# EAGLE design 30w developer board v2 (EAGLE 5.07)
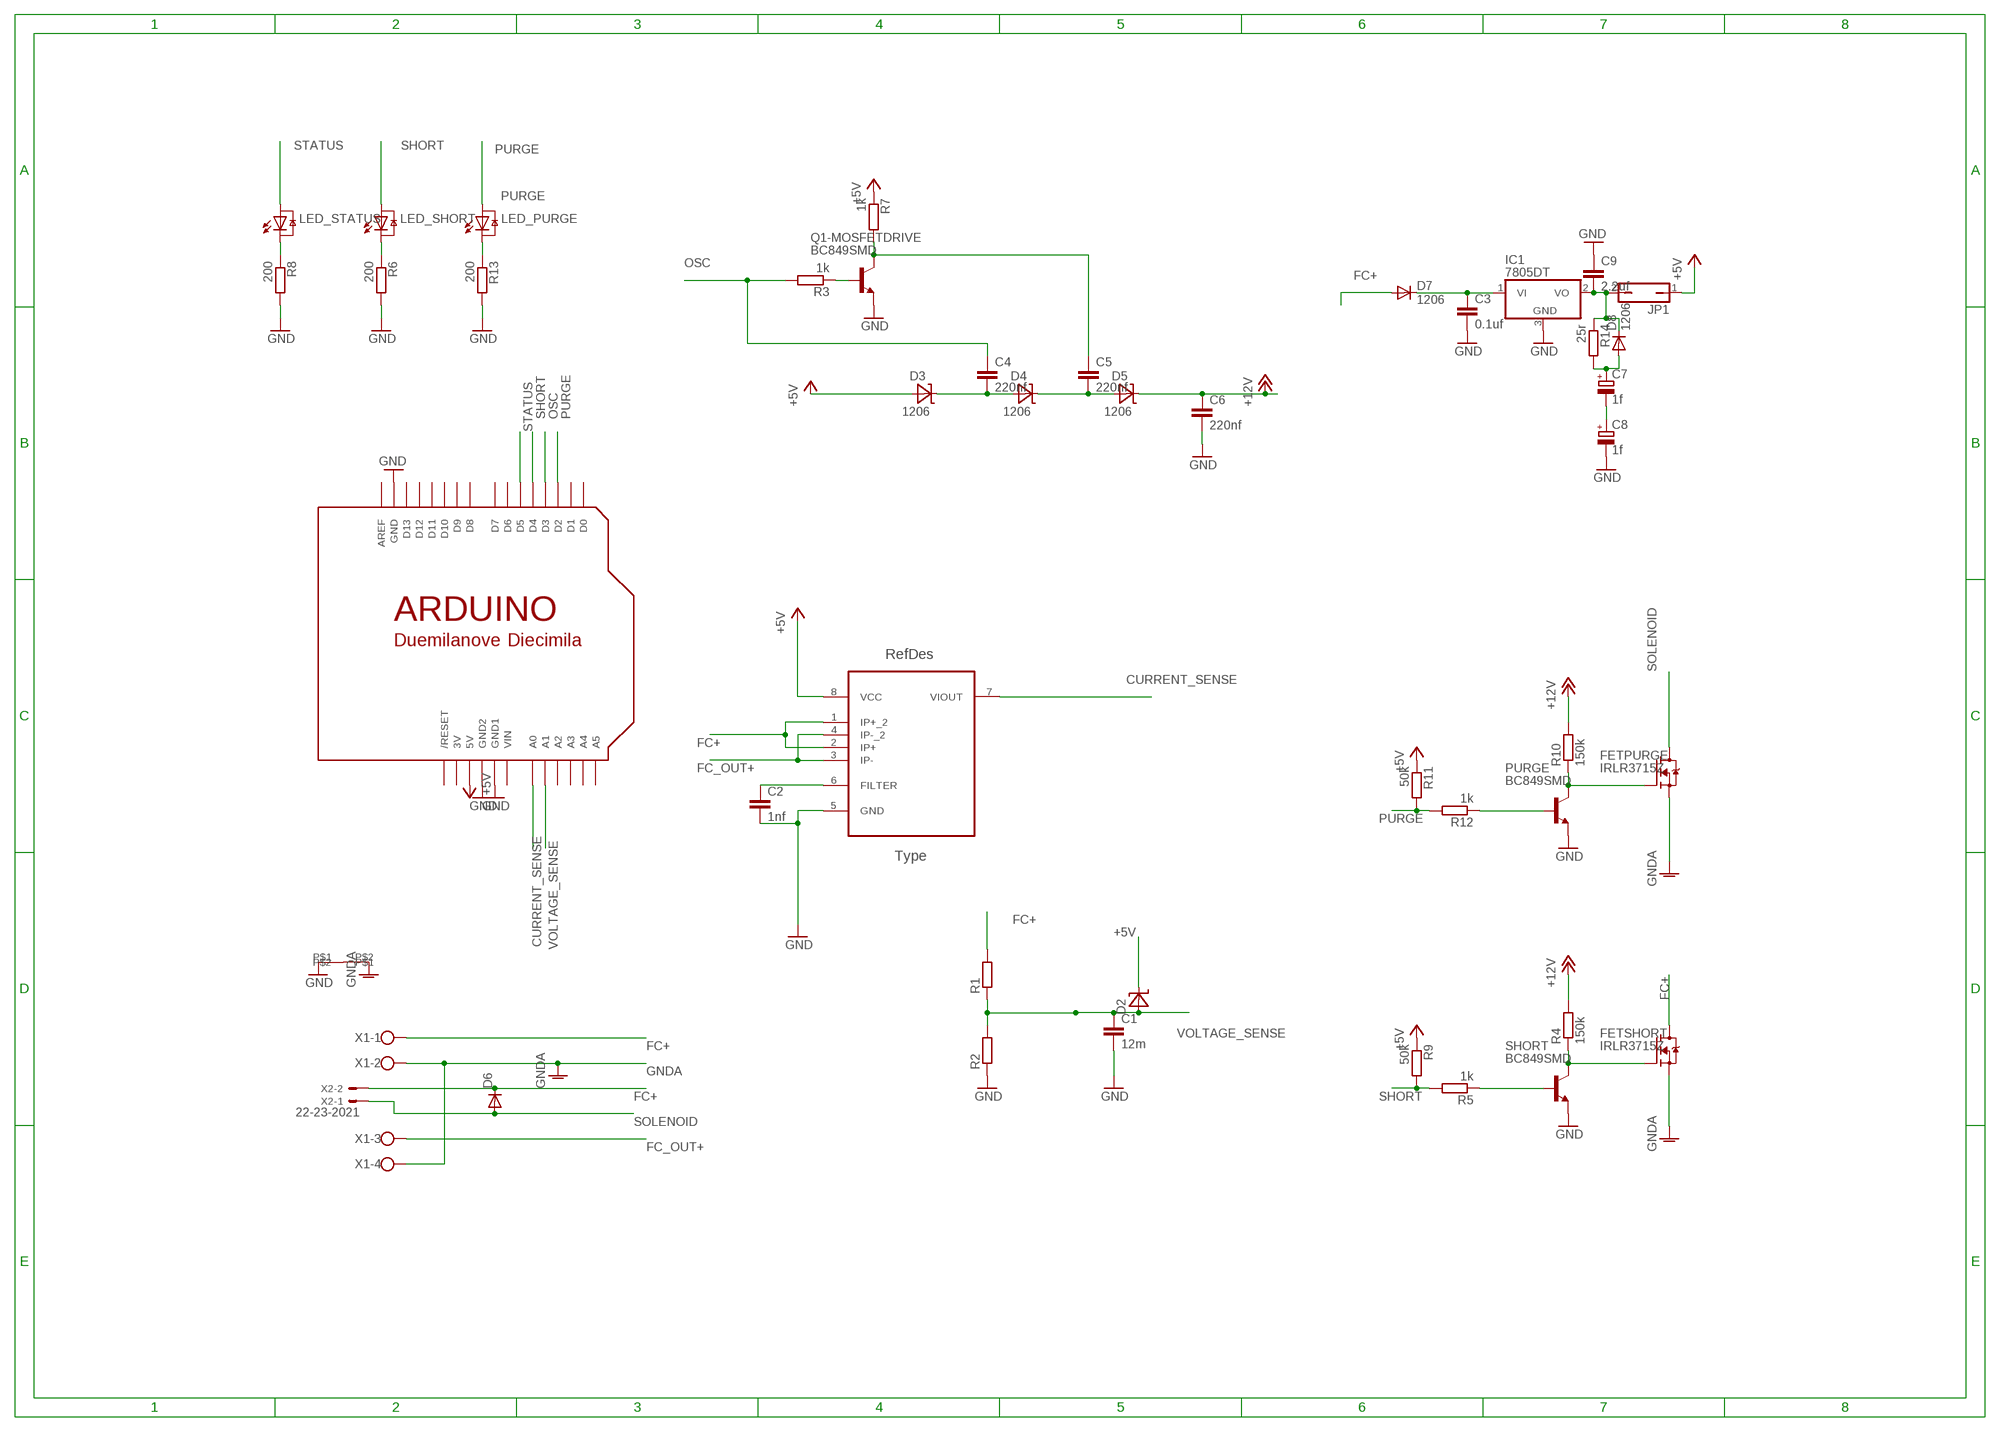
[diagram p0: schematic, sheet 1]

## Parts
C1  12m  C-EUC1206  [C1206]
C2  1nf  C-EUC1206  [C1206]
C3  0.1uf  C-EUC1206  [C1206]
C4  220nf  C-EUC1206  [C1206]
C5  220nf  C-EUC1206  [C1206]
C6  220nf  C-EUC1206  [C1206]
C7  1f  CPOL-EUE5-10.5  [E5-10,5]
C8  1f  CPOL-EUE5-10.5  [E5-10,5]
C9  2.2uf  C-EUC1206  [C1206]
D2  1206ZENER  [C1206]
D3  1206  [C1206]
D4  1206  [C1206]
D5  1206  [C1206]
D6  DIODE-GF1  [GF1]
D7  1206  DIODE-GF1  [GF1]
D8  1206  DIODE-GF1  [GF1]
FETPURGE  IRLR3715Z  [TO252]
FETSHORT  IRLR3715Z  [TO252]
IC1  7805DT  [TO252]
JP1  JP1Q  [JP1]
LED_PURGE  GM5BW96385A  [GM5BW96385A]
LED_SHORT  GM5BW96385A  [GM5BW96385A]
LED_STATUS  GM5BW96385A  [GM5BW96385A]
PURGE  BC849SMD  [SOT23-BEC]
Q1-MOSFETDRIVE  BC849SMD  [SOT23-BEC]
R1  R-EU_R1206  [R1206]
R2  R-EU_R1206  [R1206]
R3  1k  R-EU_M1206  [M1206]
R4  150k  R-EU_M1206  [M1206]
R5  1k  R-EU_M1206  [M1206]
R6  200  R-EU_M1206  [M1206]
R7  1k  R-EU_M1206  [M1206]
R8  200  R-EU_M1206  [M1206]
R9  50k  R-EU_M1206  [M1206]
R10  150k  R-EU_M1206  [M1206]
R11  50k  R-EU_M1206  [M1206]
R12  1k  R-EU_M1206  [M1206]
R13  200  R-EU_M1206  [M1206]
R14  25r  R-EU_M1206  [M1206]
SHORT  BC849SMD  [SOT23-BEC]
U1  ACS712ELCTR-05B-T  [SOIC127P600X175-8N]
U$1  ARDUINO-NOHOLE  [ARDUINO-NOHOLE]
U$2  SHORT  [SHORT]
X1  W237-4  [W237-4]
X2  22-23-2021  [22-23-2021]

## Nets
+5V [medpower]: D2.CATHODE(C) D3.ANODE(A) JP1.1 R7.1 R9.1 R11.1 U1.8(VCC) U$1.5V
+12V: C6.1 D5.CATHODE(C) R4.2 R10.2
CURRENT_SENSE: U1.7(VIOUT) U$1.A0
FC+ [power]: D6.C D7.A FETSHORT.3(D) R1.2 U1.1(IP+_2) U1.2(IP+) X1.1 X2.2
FC_OUT+ [power]: U1.3(IP-) U1.4(IP-_2) X1.3
GND [medpower]: C1.2 C2.2 C3.2 C6.2 C8.- C9.1 IC1.3(GND) PURGE.E Q1-MOSFETDRIVE.E R2.1 R6.2 R8.2 R13.2 SHORT.E U1.5(GND) U$1.GND U$1.GND1 U$1.GND2 U$2.P$1
GNDA [power]: FETPURGE.2(S) FETSHORT.2(S) U$2.P$2 X1.2 X1.4
N$1: C9.2 D8.C IC1.2(VO) JP1.2 R14.1
N$2: C7.- C8.+
N$3: FETSHORT.1(G) R4.1 SHORT.C
N$4: FETPURGE.1(G) PURGE.C R10.1
N$5: C2.1 U1.6(FILTER)
N$6: C4.2 D3.CATHODE(C) D4.ANODE(A)
N$7: C5.2 D4.CATHODE(C) D5.ANODE(A)
N$8: PURGE.B R12.1
N$9: C3.1 D7.C IC1.1(VI)
N$11: C5.1 Q1-MOSFETDRIVE.C R7.2
N$12: Q1-MOSFETDRIVE.B R3.1
N$13: LED_SHORT.C R6.1
N$14: R5.1 SHORT.B
N$15: LED_PURGE.C R13.1
N$16: LED_STATUS.C R8.1
N$17: C7.+ D8.A R14.2
OSC: C4.1 R3.2 U$1.D3
PURGE: LED_PURGE.A R11.2 R12.2 U$1.D2
SHORT: LED_SHORT.A R5.2 R9.2 U$1.D4
SOLENOID [medpower]: D6.A FETPURGE.3(D) X2.1
STATUS: LED_STATUS.A U$1.D5
VOLTAGE_SENSE: C1.1 D2.ANODE(A) R1.1 R2.2 U$1.A1
Unconnected: U$1.A2 U$1.A3 U$1.A4 U$1.A5 U$1.AREF U$1.D0 U$1.D1 U$1.D6 U$1.D7 U$1.D8 U$1.D9 U$1.D10 U$1.D11 U$1.D12 U$1.D13 U$1.RESET(/RESET)

## Power pins joined to a net without a drawn wire
3V: U$1.3V
VIN: U$1.VIN

## Library data of the parts
C1 C2 = matt rcl:C-EU: CAPACITOR, European symbol
C3-C6 C9 = resistor:C-EU: CAPACITOR, European symbol
C7 C8 = matt rcl:CPOL-EU: POLARIZED CAPACITOR, European symbol
D2 = matt diode:1206ZENER
D3-D5 = matt diode:1206
D6-D8 = matt diode:DIODE-: DIODE
FETPURGE FETSHORT = matt transistor-fet:IRLR3715Z
IC1 = linear:78*: Positive VOLTAGE REGULATOR Source: http://cache.national.com/ds/LM/LM78L05.pdf http://www.fairchildsemi.com/ds/LM/LM7805.pdf
JP1 = jumper:JP1Q: JUMPER
LED_PURGE LED_SHORT LED_STATUS = matt led:GM5BW96385A: High brightness White Color LED 2300 mcd @ IF = 20mA achieved via InGaN Blue LED chip in combination with Yellow Phosphor Source: http://document.sharpsma.com/files/GM5BW96385A.pdf
PURGE Q1-MOSFETDRIVE SHORT = matt transistor-npn:BC849*: NPN Transistor
R1 R2 = matt rcl:R-EU_: RESISTOR, European symbol
R3-R14 = resistor:R-EU_: RESISTOR, European symbol
U1 = matt-allegro:ACS712ELCTR-05B-T: Linear Current Sensor; DESCRIPTION: Linear Current Sensor; MPN: ACS712ELCTR-05B-T; OC_FARNELL: 27M3644; OC_NEWARK: 1329623; PACKAGE: SOIC-8; SUPPLIER: Allegro
U$1 = adafruit:ARDUINO: Arduino Diecimila/Duemilanove Make a shield with ease, this package has all the named pins as well as the two mounting drill holes and an outline of the USB and DC power connector. The outline is on the DIMENSION layer, so if your board house uses it they will cut the outline to match. http://www.ladyada.net/library/pcb/eaglelibrary.html
U$2 = matt:SHORT
X1 = con-wago-500:W237-4: WAGO SCREW CLAMP
X2 = con-molex:22-23-2021: .100" (2.54mm) Center Header - 2 Pin

## Net classes
1 power: width 3 mm
2 medpower: width 1 mm

## Board
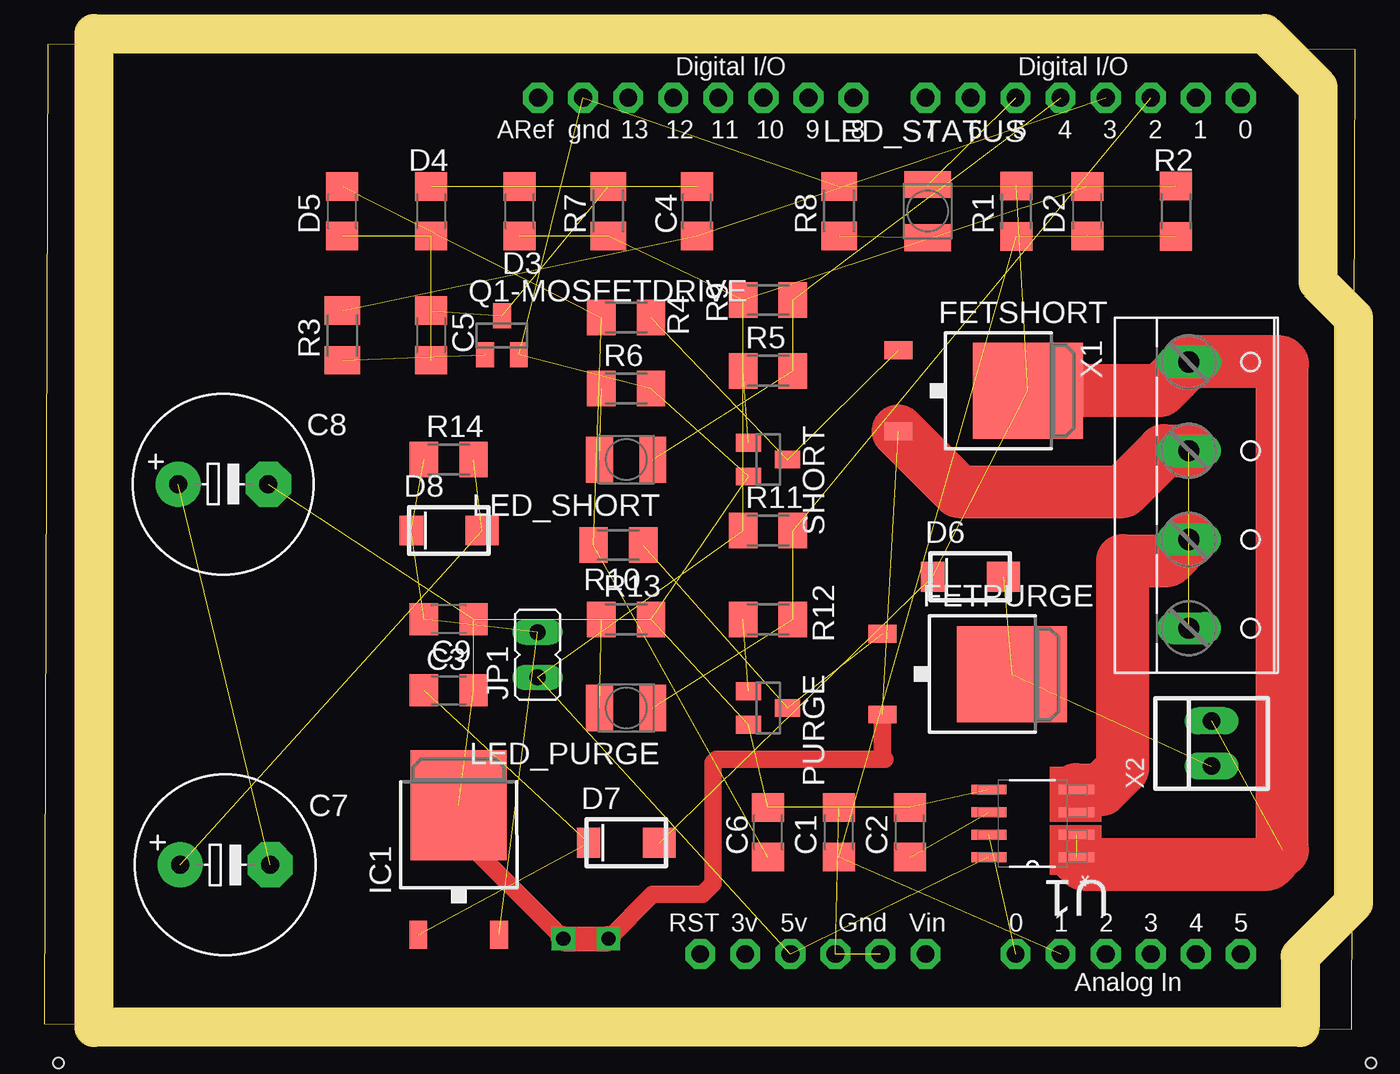
[diagram p1: board, top side]
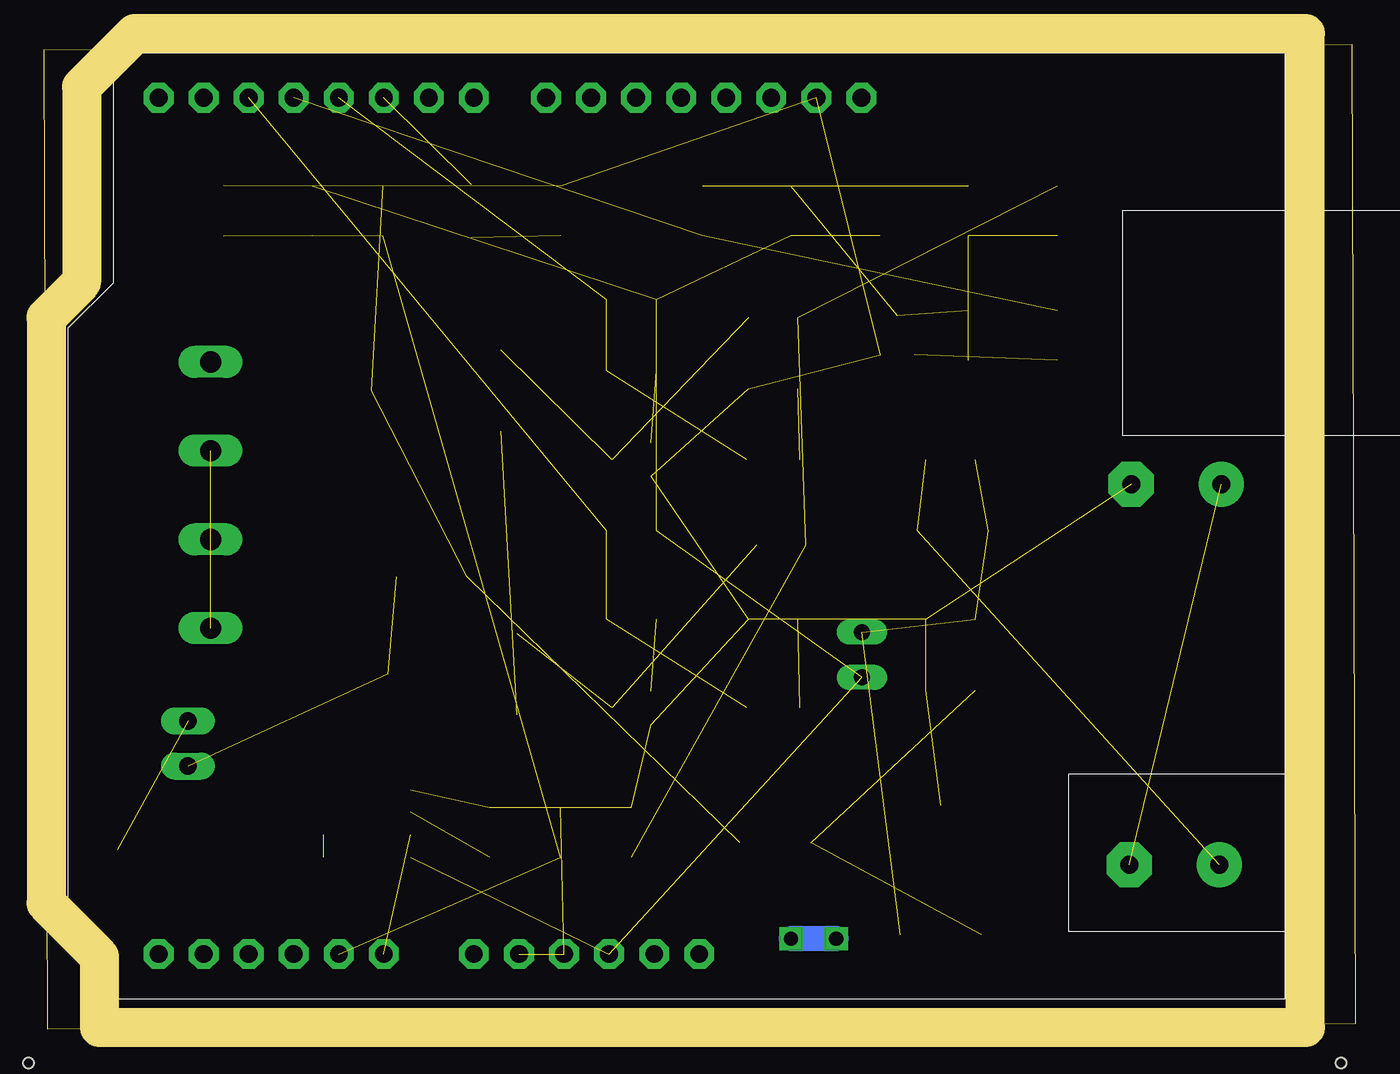
[diagram p2: board, bottom side, seen from below]

Size 73.9 x 55.5 mm. Coordinates in mm from the lower left corner, seen from the top.
Outline: 0,0.3 73.7,0 73.9,55.2 0.2,55.5 0,0.3
Copper layers (1*16): Top 0.035mm / dielectric 1.5mm / Bottom 0.035mm
Design rules "default *": minimum track width 0.5mm, minimum drill 24mil, track to track 8mil, track to pad 8mil, pad to pad 8mil, via to via 8mil, smd to smd 8mil, copper to edge 40mil, drill to drill 8mil, minimum pad ring 10mil, minimum via ring 8mil, stop-mask expansion 4mil, vias tented up to drill 0mil, thermal gap 10mil
Holes 0.6 mm at 0.8,-1.9 74.8,-1.9
Milling: 9 lines

### Footprints (pad centres in the part's own frame; a part is rotated, then mirrored left to right if it is on the bottom)
C1206 = smd 1.6 x 1.8: 1 -1.4,0; 2 1.4,0
E5-10,5 = drill 1.016 pad 2.54 round: + -2.54,0 | drill 1.016 pad 2.54 octagon: - 2.54,0
C1206' = smd 1.6 x 1.8: ANODE -1.4,0; CATHODE 1.4,0
GF1 = smd 1.85 x 1.68: A 1.87,0 | smd 1.32 x 1.68: C -2.12,0
TO252 = smd 1 x 1.6: 1 -2.28,-4.8; 2 2.28,-4.8 | smd 5.4 x 6.2: 3 0,2.5
JP1 = drill 0.914 long: 1 0,-1.27; 2 0,1.27
GM5BW96385A = smd 1.5 x 2.6: A -1.5,0; C 1.5,0
SOT23-BEC = smd 1 x 1.4: B -0.95,-1.1; C 0,1.1; E 0.95,-1.1
R1206 = smd 1.6 x 1.803: 1 -1.422,0; 2 1.422,0
M1206 = smd 1.6 x 2: 1 -1.4,0; 2 1.4,0
SOIC127P600X175-8N = smd 1.981 x 0.559: 1 -2.464,1.905; 2 -2.464,0.635; 3 -2.464,-0.635; 4 -2.464,-1.905; 5 2.464,-1.905; 6 2.464,-0.635; 7 2.464,0.635; 8 2.464,1.905
ARDUINO-NOHOLE = drill 1 pad 1.676 octagon: 3V 35.56,2.54; 5V 38.1,2.54; A0 50.8,2.54; A1 53.34,2.54; A2 55.88,2.54; A3 58.42,2.54; A4 60.96,2.54; A5 63.5,2.54; AREF 23.876,50.8; D0 63.5,50.8; D1 60.96,50.8; D2 58.42,50.8; D3 55.88,50.8; D4 53.34,50.8; D5 50.8,50.8; D6 48.26,50.8; D7 45.72,50.8; D8 41.656,50.8; D9 39.116,50.8; D10 36.576,50.8; D11 34.036,50.8; D12 31.496,50.8; D13 28.956,50.8; GND 26.416,50.8; GND1 43.18,2.54; GND2 40.64,2.54; RESET 33.02,2.54; VIN 45.72,2.54
SHORT = drill 0.8 square: P$1 -2.54,0; P$2 0,0
W237-4 = drill 1.194 long: 1 -7.5,-1.27; 2 -2.5,-1.27; 3 2.5,-1.27; 4 7.5,-1.27
22-23-2021 = drill 1 long: 1 -1.27,0; 2 1.27,0

### Placement (x,y rotation side)
C1  44.8,11.1 90 top
C2  48.8,11.1 90 top
C3  22.8,19.1 0 top
C4  36.8,46.1 90 top
C5  21.8,39.1 270 top
C6  40.8,11.1 90 top
C7  10.2,9.26 0 top
C8  10.09,30.72 0 top
C9  22.8,23.1 180 top
D2  [C1206']  58.8,46.1 90 top
D3  1206  [C1206']  26.8,46.1 90 top
D4  1206  [C1206']  21.8,46.1 270 top
D5  1206  [C1206']  16.8,46.1 90 top
D6  52.2,25.5 0 top
D7  32.8,10.5 0 top
D8  22.8,28.1 0 top
FETPURGE  52.05,20.01 270 top
FETSHORT  52.95,35.98 270 top
IC1  23.36,10.12 0 top
JP1  27.8,21.1 0 top
LED_PURGE  32.8,18.1 180 top
LED_SHORT  32.8,32.1 180 top
LED_STATUS  49.8,46.1 270 top
PURGE  40.8,18.1 270 top
Q1-MOSFETDRIVE  25.8,39.1 0 top
R1  54.8,46.1 90 top
R2  63.8,46.1 270 top
R3  16.8,39.1 90 top
R4  32.8,40.1 180 top
R5  40.8,37.1 0 top
R6  32.8,36.1 0 top
R7  31.8,46.1 90 top
R8  44.8,46.1 90 top
R9  40.8,41.1 0 top
R10  32.36,27.28 180 top
R11  40.8,28.1 0 top
R12  40.8,23.1 0 top
R13  32.8,23.1 0 top
R14  22.8,32.1 0 top
SHORT  40.8,32.1 270 top
U1  55.71,11.6 180 top
U$1  3.96,1.69 0 top
U$2  31.8,5.1 0 top
X1  65.8,30.1 270 top
X2  65.8,16.1 90 top

### Tracks (layer width: path | path; a pad name or v marks a point on that pad's centre or on a via)
+5V  (7 unrouted)
+12V  (3 unrouted)
CURRENT_SENSE  (1 unrouted)
FC+  (5 unrouted)
  Top 3: U1.1 58.57,9.3 69,9.3 69.8,10.1 69.8,37.5 69.7,37.6 X1.1 62.91,35.98 FETSHORT.3
FC_OUT+
  Top 1.016: U1.4 58.1,13.58 58.1,13.6 58.3,13.6 58.2,13.5 | 58.2,13.5 58,13.3 58,13.2 58.17,13.03 U1.3 | 58.2,13.5 58.2,12.6 58.3,12.7 58.6,12.7
  Top 3: X1.3 63.33,26.4 60.8,26.4 60.8,14.7 59.6,13.5 U1.4
GND  (17 unrouted)
  Top 1: U$2.P$1 23.36,11 IC1.3
GNDA  (2 unrouted)
  Top 1: U$2.P$2 34.3,7.6 37.1,7.6 37.7,8.2 37.7,15 37.9,15.2 47.4,15.2 47.25,15.35 FETPURGE.2
  Top 3: FETSHORT.2 51.55,30.3 60.8,30.3 63.1,32.6 X1.2
N$1  (4 unrouted)
N$2  (1 unrouted)
N$3  (2 unrouted)
N$4  (2 unrouted)
N$5  (1 unrouted)
N$6  (2 unrouted)
N$7  (2 unrouted)
N$8  (1 unrouted)
N$9  (2 unrouted)
N$11  (2 unrouted)
N$12  (1 unrouted)
N$13  (1 unrouted)
N$14  (1 unrouted)
N$15  (1 unrouted)
N$16  (1 unrouted)
N$17  (2 unrouted)
OSC  (2 unrouted)
PURGE  (3 unrouted)
SHORT  (3 unrouted)
SOLENOID  (2 unrouted)
STATUS  (1 unrouted)
VOLTAGE_SENSE  (4 unrouted)
(copper drawn outside any net)
  shapes: Top area x2